# Altium project Baicuoiki.PrjPcb
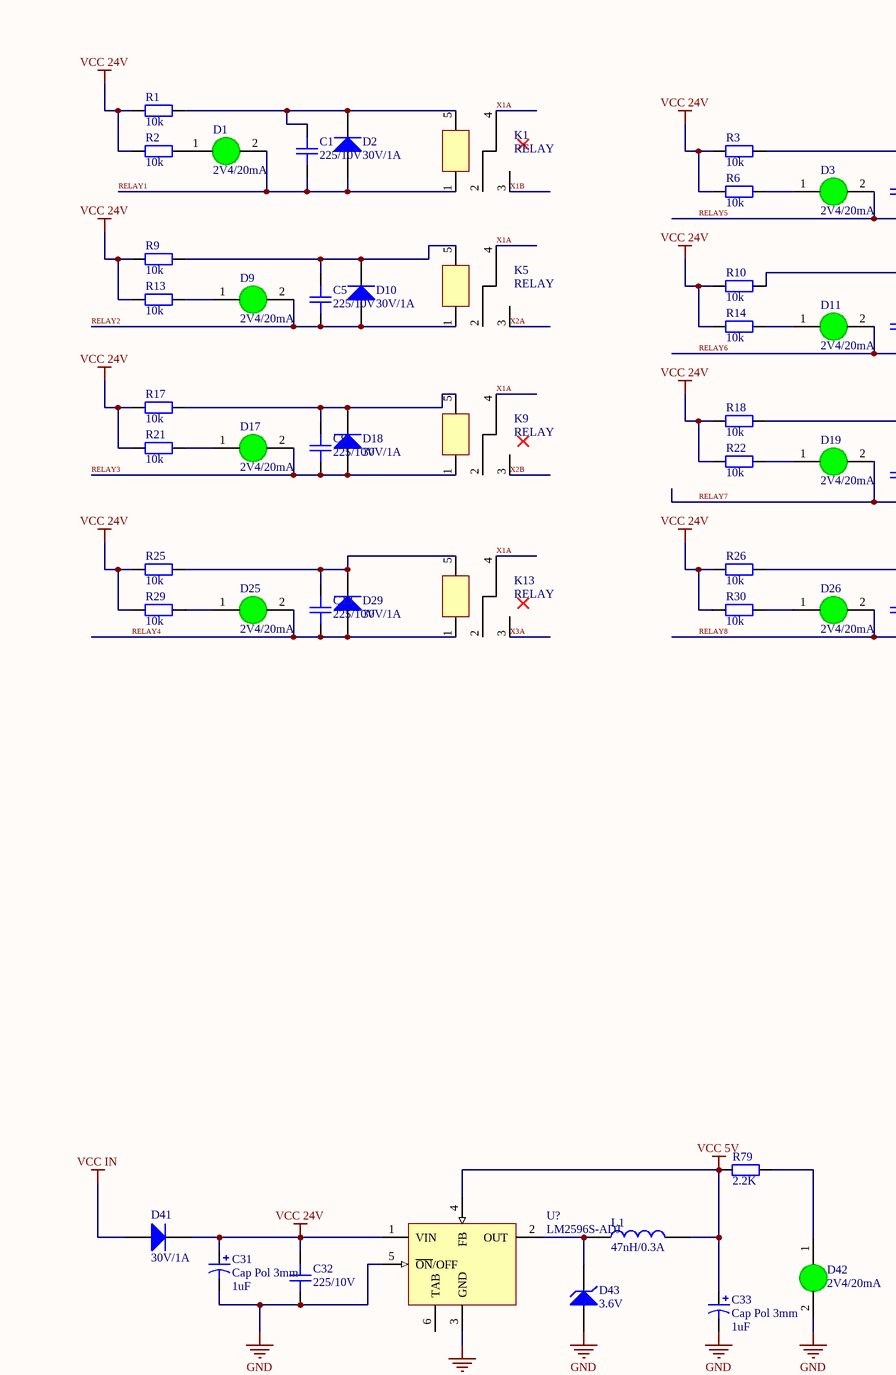
[diagram p0: baicuoiki.SchDoc, top left]
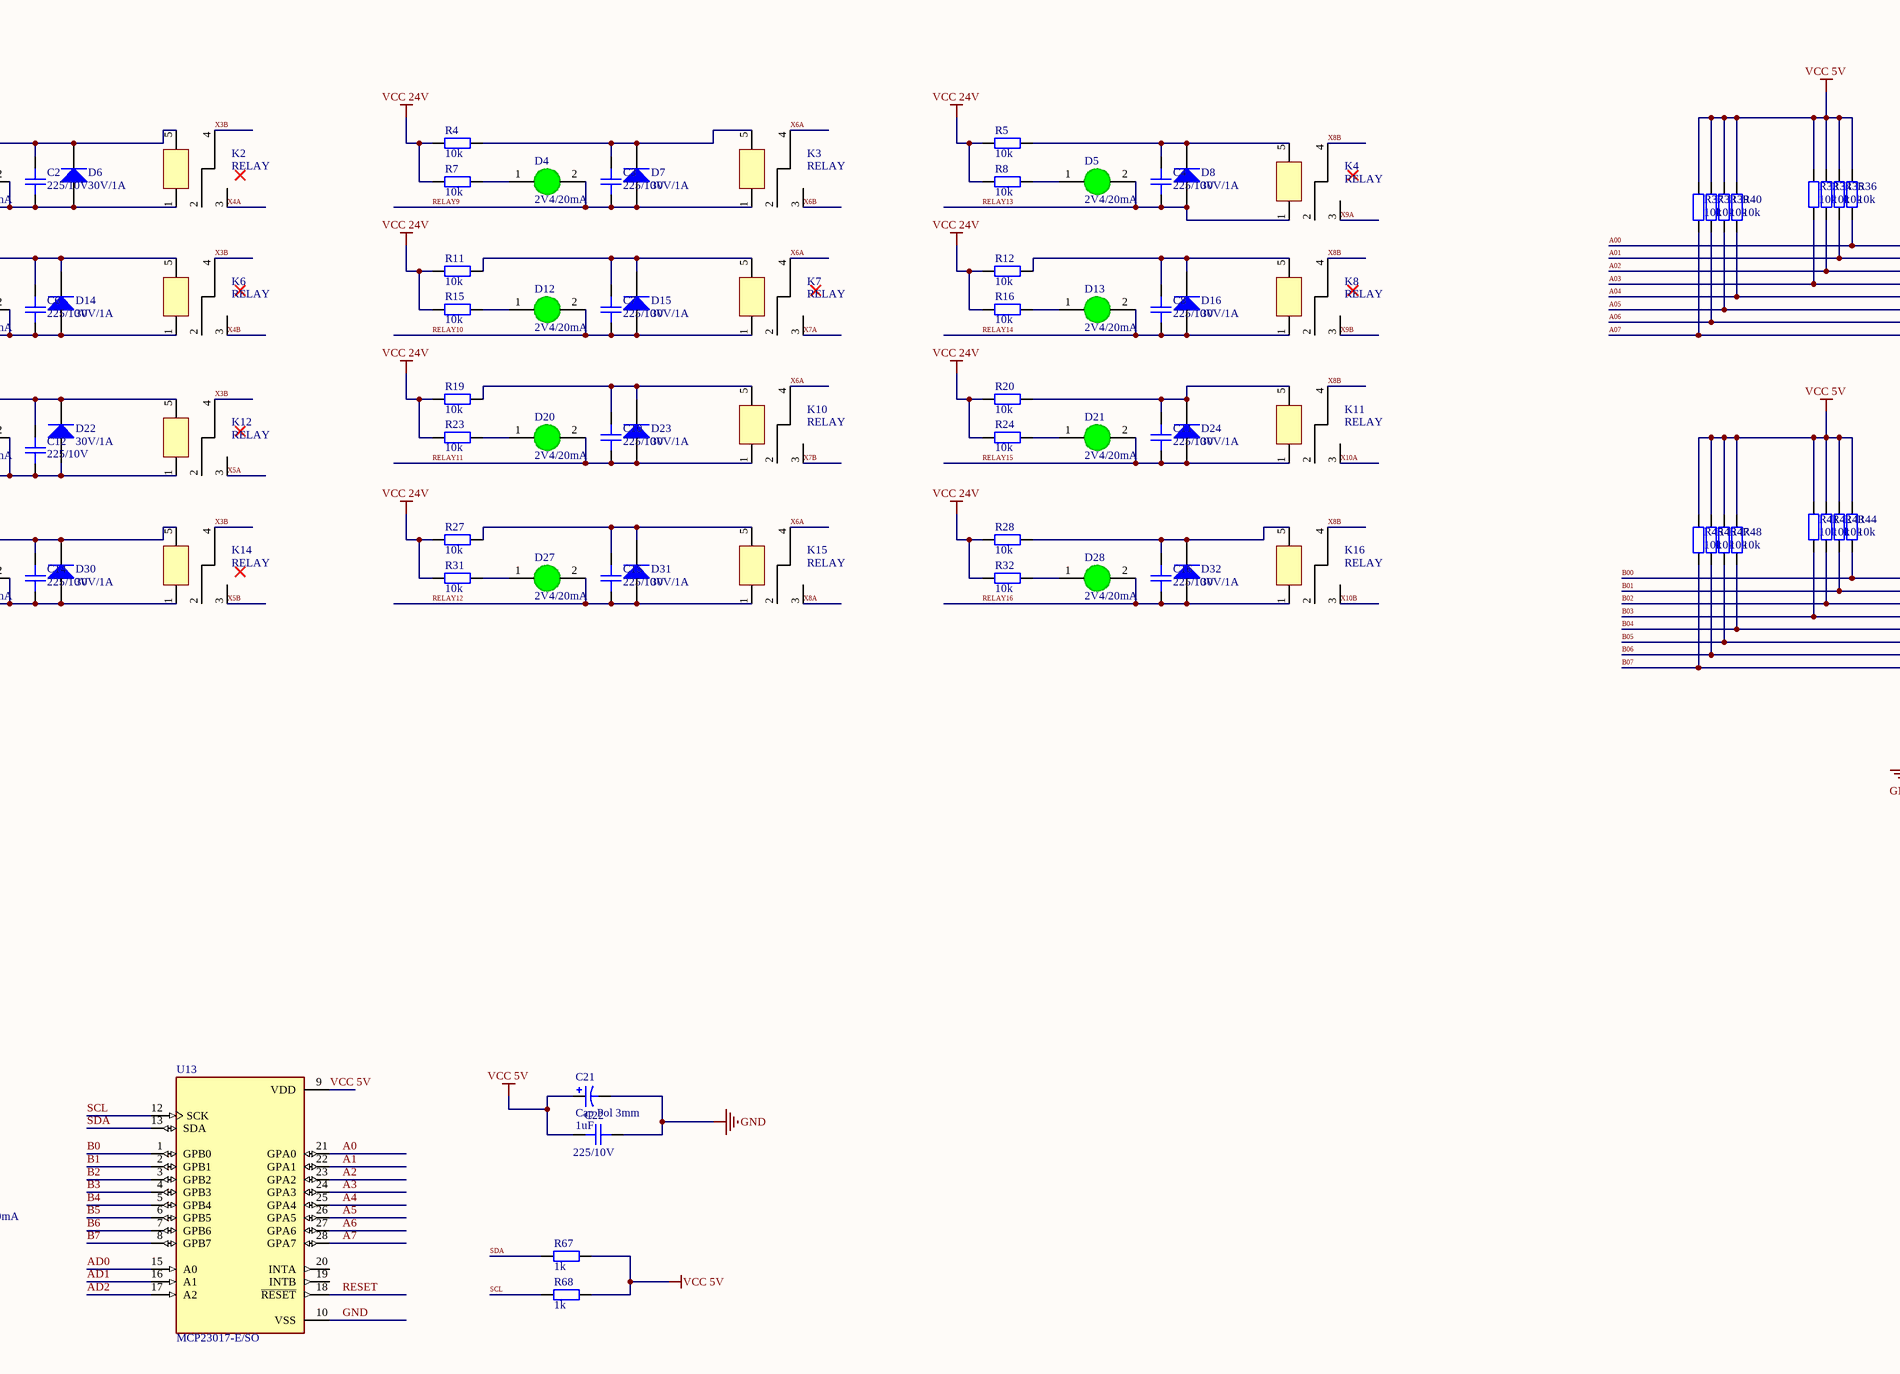
[diagram p1: baicuoiki.SchDoc, top middle]
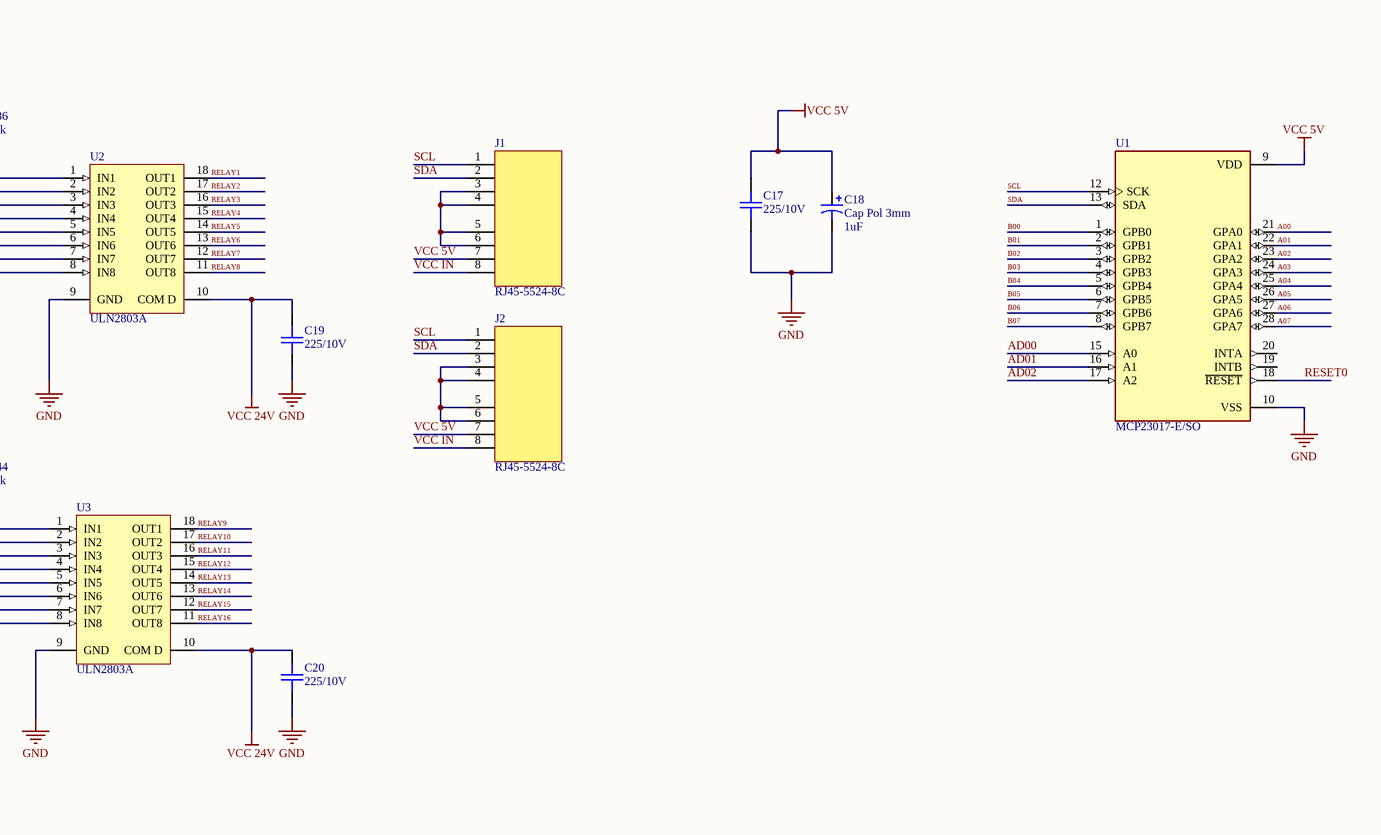
[diagram p2: baicuoiki.SchDoc, top right]
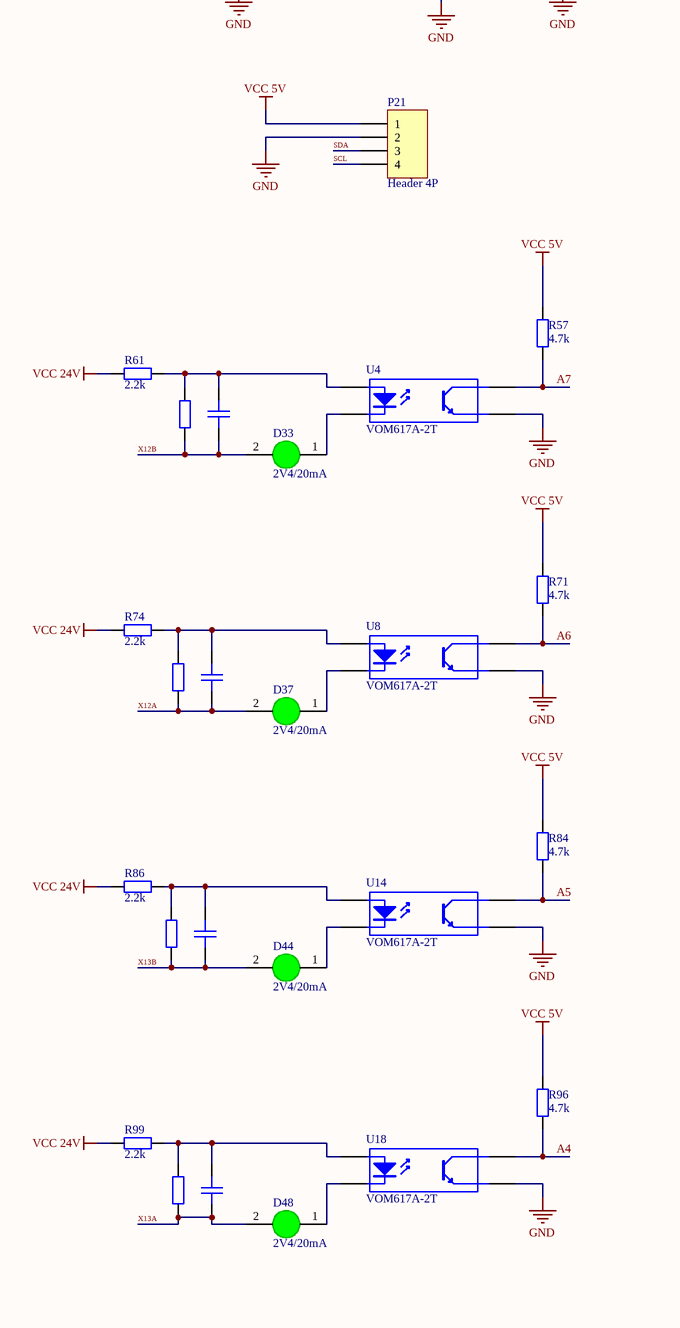
[diagram p3: baicuoiki.SchDoc, bottom left]
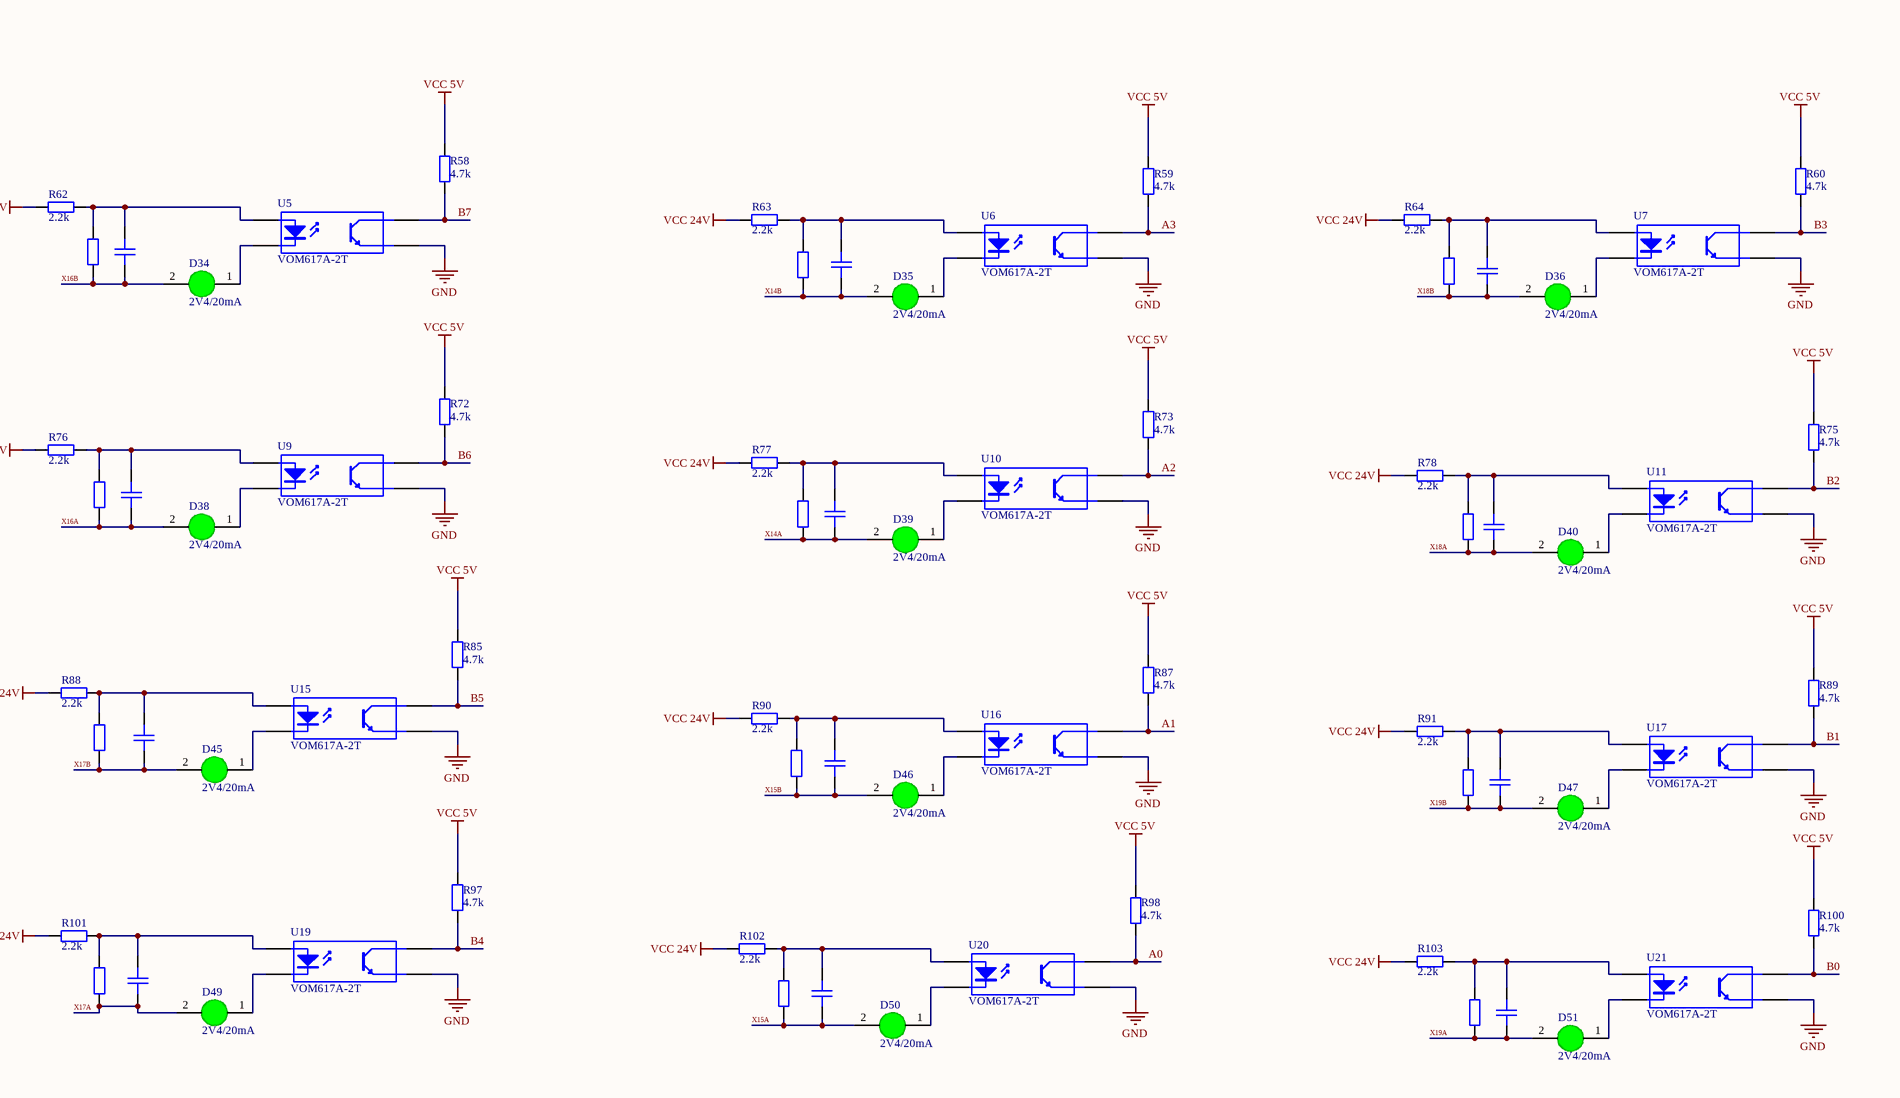
[diagram p4: baicuoiki.SchDoc, bottom middle]
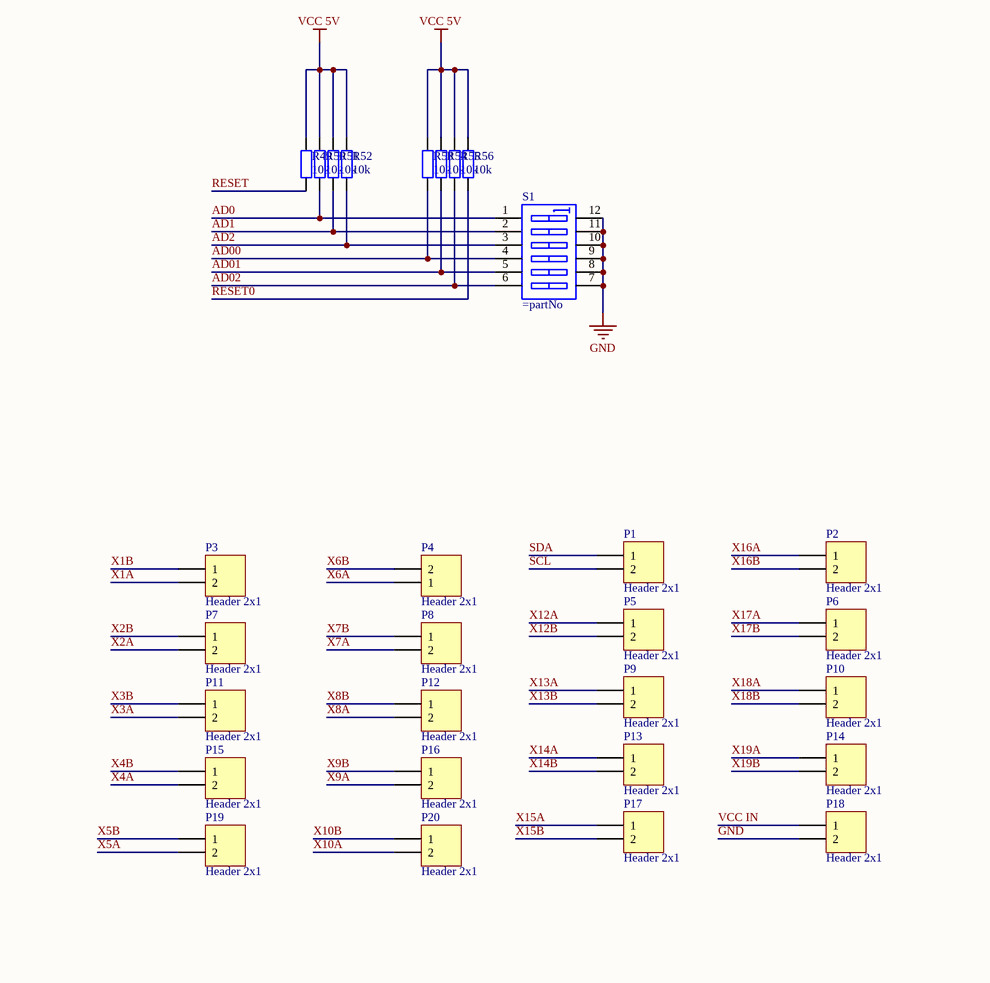
[diagram p5: baicuoiki.SchDoc, bottom right]
1 sheet, 261 parts. Net scope: global (net labels, ports and power ports of the same name join across sheets).
Board file: baicuoiki.PcbDoc

## Sheet baicuoiki.SchDoc
size D

### Parts
C1  225/10V  [CAPC-0805 (2012)]
C2  225/10V  [CAPC-0805 (2012)]
C3  225/10V  [CAPC-0805 (2012)]
C4  225/10V  [CAPC-0805 (2012)]
C5  225/10V  [CAPC-0805 (2012)]
C6  225/10V  [CAPC-0805 (2012)]
C7  225/10V  [CAPC-0805 (2012)]
C8  225/10V  [CAPC-0805 (2012)]
C9  225/10V  [CAPC-0805 (2012)]
C10  225/10V  [CAPC-0805 (2012)]
C11  225/10V  [CAPC-0805 (2012)]
C12  225/10V  [CAPC-0805 (2012)]
C13  225/10V  [CAPC-0805 (2012)]
C14  225/10V  [CAPC-0805 (2012)]
C15  225/10V  [CAPC-0805 (2012)]
C16  225/10V  [CAPC-0805 (2012)]
C17  225/10V  [CAPC-0805 (2012)]
C18  Cap Pol 3mm  [CAPC-0603 (1608)]
C19  225/10V  [CAPC-0805 (2012)]
C20  225/10V  [CAPC-0805 (2012)]
C21  Cap Pol 3mm  [C3MM]
C22  225/10V  [CAPC-0805 (2012)]
C23  225/10V  [CAPC-0805 (2012)]  (value not drawn)
C24  225/10V  [CAPC-0805 (2012)]  (value not drawn)
C25  225/10V  [CAPC-0805 (2012)]  (value not drawn)
C26  225/10V  [CAPC-0805 (2012)]  (value not drawn)
C27  225/10V  [CAPC-0805 (2012)]  (value not drawn)
C28  225/10V  [CAPC-0805 (2012)]  (value not drawn)
C29  225/10V  [CAPC-0805 (2012)]  (value not drawn)
C30  225/10V  [CAPC-0805 (2012)]  (value not drawn)
C31  Cap Pol 3mm  [C3MM]
C32  225/10V  [CAPC-0805 (2012)]
C33  Cap Pol 3mm  [C3MM]
C34  225/10V  [CAPC-0805 (2012)]  (value not drawn)
C35  225/10V  [CAPC-0805 (2012)]  (value not drawn)
C36  225/10V  [CAPC-0805 (2012)]  (value not drawn)
C37  225/10V  [CAPC-0805 (2012)]  (value not drawn)
C38  225/10V  [CAPC-0805 (2012)]  (value not drawn)
C39  225/10V  [CAPC-0805 (2012)]  (value not drawn)
C40  225/10V  [CAPC-0805 (2012)]  (value not drawn)
C41  225/10V  [CAPC-0805 (2012)]  (value not drawn)
D1  2V4/20mA  [LED_0805_GREEN]
D2  30V/1A  [DIODE_DFLS130L]
D3  2V4/20mA  [LED_0805_GREEN]
D4  2V4/20mA  [LED_0805_GREEN]
D5  2V4/20mA  [LED_0805_GREEN]
D6  30V/1A  [DIODE_DFLS130L]
D7  30V/1A  [DIODE_DFLS130L]
D8  30V/1A  [DIODE_DFLS130L]
D9  2V4/20mA  [LED_0805_GREEN]
D10  30V/1A  [DIODE_DFLS130L]
D11  2V4/20mA  [LED_0805_GREEN]
D12  2V4/20mA  [LED_0805_GREEN]
D13  2V4/20mA  [LED_0805_GREEN]
D14  30V/1A  [DIODE_DFLS130L]
D15  30V/1A  [DIODE_DFLS130L]
D16  30V/1A  [DIODE_DFLS130L]
D17  2V4/20mA  [LED_0805_GREEN]
D18  30V/1A  [DIODE_DFLS130L]
D19  2V4/20mA  [LED_0805_GREEN]
D20  2V4/20mA  [LED_0805_GREEN]
D21  2V4/20mA  [LED_0805_GREEN]
D22  30V/1A  [DIODE_DFLS130L]
D23  30V/1A  [DIODE_DFLS130L]
D24  30V/1A  [DIODE_DFLS130L]
D25  2V4/20mA  [LED_0805_GREEN]
D26  2V4/20mA  [LED_0805_GREEN]
D27  2V4/20mA  [LED_0805_GREEN]
D28  2V4/20mA  [LED_0805_GREEN]
D29  30V/1A  [DIODE_DFLS130L]
D30  30V/1A  [DIODE_DFLS130L]
D31  30V/1A  [DIODE_DFLS130L]
D32  30V/1A  [DIODE_DFLS130L]
D33  2V4/20mA  [LED_0805_GREEN]
D34  2V4/20mA  [LED_0805_GREEN]
D35  2V4/20mA  [LED_0805_GREEN]
D36  2V4/20mA  [LED_0805_GREEN]
D37  2V4/20mA  [LED_0805_GREEN]
D38  2V4/20mA  [LED_0805_GREEN]
D39  2V4/20mA  [LED_0805_GREEN]
D40  2V4/20mA  [LED_0805_GREEN]
D41  30V/1A  [DIODE_DFLS130L]
D42  2V4/20mA  [LED_0805_GREEN]
D43  3.6V  [SOD-123]
D44  2V4/20mA  [LED_0805_GREEN]
D45  2V4/20mA  [LED_0805_GREEN]
D46  2V4/20mA  [LED_0805_GREEN]
D47  2V4/20mA  [LED_0805_GREEN]
D48  2V4/20mA  [LED_0805_GREEN]
D49  2V4/20mA  [LED_0805_GREEN]
D50  2V4/20mA  [LED_0805_GREEN]
D51  2V4/20mA  [LED_0805_GREEN]
J1  RJ45-5524-8C  [RJ45_5224-8C]
J2  RJ45-5524-8C  [RJ45_5224-8C]
K1  RELAY  [RELAY]
K2  RELAY  [RELAY]
K3  RELAY  [RELAY]
K4  RELAY  [RELAY]
K5  RELAY  [RELAY]
K6  RELAY  [RELAY]
K7  RELAY  [RELAY]
K8  RELAY  [RELAY]
K9  RELAY  [RELAY]
K10  RELAY  [RELAY]
K11  RELAY  [RELAY]
K12  RELAY  [RELAY]
K13  RELAY  [RELAY]
K14  RELAY  [RELAY]
K15  RELAY  [RELAY]
K16  RELAY  [RELAY]
L1  47nH/0.3A  [IND-0603 (1608)]
P1  Header 2x1  [HED2]
P2  Header 2x1  [HED2]
P3  Header 2x1  [HED2]
P4  Header 2x1  [HED2]
P5  Header 2x1  [HED2]
P6  Header 2x1  [HED2]
P7  Header 2x1  [HED2]
P8  Header 2x1  [HED2]
P9  Header 2x1  [HED2]
P10  Header 2x1  [HED2]
P11  Header 2x1  [HED2]
P12  Header 2x1  [HED2]
P13  Header 2x1  [HED2]
P14  Header 2x1  [HED2]
P15  Header 2x1  [HED2]
P16  Header 2x1  [HED2]
P17  Header 2x1  [HED2]
P18  Header 2x1  [HED2]
P19  Header 2x1  [HED2]
P20  Header 2x1  [HED2]
P21  Header 4P  [HDR1X4]
R1  10k  [RESC-0603 (1608)]
R2  10k  [RESC-0603 (1608)]
R3  10k  [RESC-0603 (1608)]
R4  10k  [RESC-0603 (1608)]
R5  10k  [RESC-0603 (1608)]
R6  10k  [RESC-0603 (1608)]
R7  10k  [RESC-0603 (1608)]
R8  10k  [RESC-0603 (1608)]
R9  10k  [RESC-0603 (1608)]
R10  10k  [RESC-0603 (1608)]
R11  10k  [RESC-0603 (1608)]
R12  10k  [RESC-0603 (1608)]
R13  10k  [RESC-0603 (1608)]
R14  10k  [RESC-0603 (1608)]
R15  10k  [RESC-0603 (1608)]
R16  10k  [RESC-0603 (1608)]
R17  10k  [RESC-0603 (1608)]
R18  10k  [RESC-0603 (1608)]
R19  10k  [RESC-0603 (1608)]
R20  10k  [RESC-0603 (1608)]
R21  10k  [RESC-0603 (1608)]
R22  10k  [RESC-0603 (1608)]
R23  10k  [RESC-0603 (1608)]
R24  10k  [RESC-0603 (1608)]
R25  10k  [RESC-0603 (1608)]
R26  10k  [RESC-0603 (1608)]
R27  10k  [RESC-0603 (1608)]
R28  10k  [RESC-0603 (1608)]
R29  10k  [RESC-0603 (1608)]
R30  10k  [RESC-0603 (1608)]
R31  10k  [RESC-0603 (1608)]
R32  10k  [RESC-0603 (1608)]
R33  10k  [RESC-0603 (1608)]
R34  10k  [RESC-0603 (1608)]
R35  10k  [RESC-0603 (1608)]
R36  10k  [RESC-0603 (1608)]
R37  10k  [RESC-0603 (1608)]
R38  10k  [RESC-0603 (1608)]
R39  10k  [RESC-0603 (1608)]
R40  10k  [RESC-0603 (1608)]
R41  10k  [RESC-0603 (1608)]
R42  10k  [RESC-0603 (1608)]
R43  10k  [RESC-0603 (1608)]
R44  10k  [RESC-0603 (1608)]
R45  10k  [RESC-0603 (1608)]
R46  10k  [RESC-0603 (1608)]
R47  10k  [RESC-0603 (1608)]
R48  10k  [RESC-0603 (1608)]
R49  10k  [RESC-0603 (1608)]
R50  10k  [RESC-0603 (1608)]
R51  10k  [RESC-0603 (1608)]
R52  10k  [RESC-0603 (1608)]
R53  10k  [RESC-0603 (1608)]
R54  10k  [RESC-0603 (1608)]
R55  10k  [RESC-0603 (1608)]
R56  10k  [RESC-0603 (1608)]
R57  4.7k  [RESC-0603 (1608)]
R58  4.7k  [RESC-0603 (1608)]
R59  4.7k  [RESC-0603 (1608)]
R60  4.7k  [RESC-0603 (1608)]
R61  2.2k  [RESC-0603 (1608)]
R62  2.2k  [RESC-0603 (1608)]
R63  2.2k  [RESC-0603 (1608)]
R64  2.2k  [RESC-0603 (1608)]
R65  10k  [RESC-0603 (1608)]  (value not drawn)
R66  10k  [RESC-0603 (1608)]  (value not drawn)
R67  1k  [RESC-0603 (1608)]
R68  1k  [RESC-0603 (1608)]
R69  10k  [RESC-0603 (1608)]  (value not drawn)
R70  10k  [RESC-0603 (1608)]  (value not drawn)
R71  4.7k  [RESC-0603 (1608)]
R72  4.7k  [RESC-0603 (1608)]
R73  4.7k  [RESC-0603 (1608)]
R74  2.2k  [RESC-0603 (1608)]
R75  4.7k  [RESC-0603 (1608)]
R76  2.2k  [RESC-0603 (1608)]
R77  2.2k  [RESC-0603 (1608)]
R78  2.2k  [RESC-0603 (1608)]
R79  2.2K  [RESC-0603 (1608)]
R80  10k  [RESC-0603 (1608)]  (value not drawn)
R81  10k  [RESC-0603 (1608)]  (value not drawn)
R82  10k  [RESC-0603 (1608)]  (value not drawn)
R83  10k  [RESC-0603 (1608)]  (value not drawn)
R84  4.7k  [RESC-0603 (1608)]
R85  4.7k  [RESC-0603 (1608)]
R86  2.2k  [RESC-0603 (1608)]
R87  4.7k  [RESC-0603 (1608)]
R88  2.2k  [RESC-0603 (1608)]
R89  4.7k  [RESC-0603 (1608)]
R90  2.2k  [RESC-0603 (1608)]
R91  2.2k  [RESC-0603 (1608)]
R92  10k  [RESC-0603 (1608)]  (value not drawn)
R93  10k  [RESC-0603 (1608)]  (value not drawn)
R94  10k  [RESC-0603 (1608)]  (value not drawn)
R95  10k  [RESC-0603 (1608)]  (value not drawn)
R96  4.7k  [RESC-0603 (1608)]
R97  4.7k  [RESC-0603 (1608)]
R98  4.7k  [RESC-0603 (1608)]
R99  2.2k  [RESC-0603 (1608)]
R100  4.7k  [RESC-0603 (1608)]
R101  2.2k  [RESC-0603 (1608)]
R102  2.2k  [RESC-0603 (1608)]
R103  2.2k  [RESC-0603 (1608)]
R104  10k  [RESC-0603 (1608)]  (value not drawn)
R105  10k  [RESC-0603 (1608)]  (value not drawn)
R106  10k  [RESC-0603 (1608)]  (value not drawn)
R107  10k  [RESC-0603 (1608)]  (value not drawn)
S1  (no value)  [SW-DIP6]
U1  MCP23017-E/SO  [SOIC127P1030X265-28N]
U2  ULN2803A  [SO18]
U3  ULN2803A  [SO18]
U4  VOM617A-2T  [OPTO TRANSISTOR_SOP-4]
U5  VOM617A-2T  [OPTO TRANSISTOR_SOP-4]
U6  VOM617A-2T  [OPTO TRANSISTOR_SOP-4]
U7  VOM617A-2T  [OPTO TRANSISTOR_SOP-4]
U8  VOM617A-2T  [OPTO TRANSISTOR_SOP-4]
U9  VOM617A-2T  [OPTO TRANSISTOR_SOP-4]
U10  VOM617A-2T  [OPTO TRANSISTOR_SOP-4]
U11  VOM617A-2T  [OPTO TRANSISTOR_SOP-4]
U13  MCP23017-E/SO  [SOIC127P1030X265-28N]
U14  VOM617A-2T  [OPTO TRANSISTOR_SOP-4]
U15  VOM617A-2T  [OPTO TRANSISTOR_SOP-4]
U16  VOM617A-2T  [OPTO TRANSISTOR_SOP-4]
U17  VOM617A-2T  [OPTO TRANSISTOR_SOP-4]
U18  VOM617A-2T  [OPTO TRANSISTOR_SOP-4]
U19  VOM617A-2T  [OPTO TRANSISTOR_SOP-4]
U20  VOM617A-2T  [OPTO TRANSISTOR_SOP-4]
U21  VOM617A-2T  [OPTO TRANSISTOR_SOP-4]
U?  LM2596S-ADJ  [TO263-5]

### Nets
GND: C17.2 C18.2 C19.2 C20.2 C21.2 C22.2 C31.2 C32.1 C33.2 D42.2(K) D43.1(A) P18.2 P21.2 S1.7 S1.8 S1.9 S1.10 S1.11 S1.12 U1.10(VSS) U2.9(GND) U3.9(GND) U4.3 U5.3 U6.3 U7.3 U8.3 U9.3 U10.3 U11.3 U13.10(VSS) U14.3 U15.3 U16.3 U17.3 U18.3 U19.3 U20.3 U21.3 U?.3(GND) U?.5(~{ON}/OFF)
VCC 5V: C17.1 C18.1 C21.1 C22.1 C33.1 J1.7 J2.7 L1.2 P21.1 R33.1 R34.1 R35.1 R36.1 R37.1 R38.1 R39.1 R40.1 R41.1 R42.1 R43.1 R44.1 R45.1 R46.1 R47.1 R48.1 R49.1 R50.1 R51.1 R52.1 R53.1 R54.1 R55.1 R56.1 R57.1 R58.1 R59.1 R60.1 R67.1 R68.1 R71.1 R72.1 R73.1 R75.1 R79.2 R84.1 R85.1 R87.1 R89.1 R96.1 R97.1 R98.1 R100.1 U1.9(VDD) U13.9(VDD) U?.4(FB)
VCC 24V: C19.1 C20.1 C31.1 C32.2 D41.2(K) R1.2 R2.2 R3.2 R4.2 R5.2 R6.2 R7.2 R8.2 R9.2 R10.2 R11.2 R12.2 R13.2 R14.2 R15.2 R16.2 R17.2 R18.2 R19.2 R20.2 R21.2 R22.2 R23.2 R24.2 R25.2 R26.2 R27.2 R28.2 R29.2 R30.2 R31.2 R32.2 R61.2 R62.2 R63.2 R64.2 R74.2 R76.2 R77.2 R78.2 R86.2 R88.2 R90.2 R91.2 R99.2 R101.2 R102.2 R103.2 U2.10(COM_D) U3.10(COM_D) U?.1(VIN)
VCC IN: D41.1(A) J1.8 J2.8 P18.1
A00: R36.2 U1.21(GPA0) U2.1(IN1)
A0: R98.2 U13.21(GPA0) U20.4
A01: R35.2 U1.22(GPA1) U2.2(IN2)
A1: R87.2 U13.22(GPA1) U16.4
A02: R34.2 U1.23(GPA2) U2.3(IN3)
A2: R73.2 U10.4 U13.23(GPA2)
A03: R33.2 U1.24(GPA3) U2.4(IN4)
A3: R59.2 U6.4 U13.24(GPA3)
A04: R40.2 U1.25(GPA4) U2.5(IN5)
A4: R96.2 U13.25(GPA4) U18.4
A05: R39.2 U1.26(GPA5) U2.6(IN6)
A5: R84.2 U13.26(GPA5) U14.4
A06: R38.2 U1.27(GPA6) U2.7(IN7)
A6: R71.2 U8.4 U13.27(GPA6)
A07: R37.2 U1.28(GPA7) U2.8(IN8)
A7: R57.2 U4.4 U13.28(GPA7)
AD00: R53.2 S1.4 U1.15(A0)
AD0: R50.2 S1.1 U13.15(A0)
AD01: R54.2 S1.5 U1.16(A1)
AD1: R51.2 S1.2 U13.16(A1)
AD02: R55.2 S1.6 U1.17(A2)
AD2: R52.2 S1.3 U13.17(A2)
B00: R44.2 U1.1(GPB0) U3.1(IN1)
B0: R100.2 U13.1(GPB0) U21.4
B01: R43.2 U1.2(GPB1) U3.2(IN2)
B1: R89.2 U13.2(GPB1) U17.4
B02: R42.2 U1.3(GPB2) U3.3(IN3)
B2: R75.2 U11.4 U13.3(GPB2)
B03: R41.2 U1.4(GPB3) U3.4(IN4)
B3: R60.2 U7.4 U13.4(GPB3)
B04: R48.2 U1.5(GPB4) U3.5(IN5)
B4: R97.2 U13.5(GPB4) U19.4
B05: R47.2 U1.6(GPB5) U3.6(IN6)
B5: R85.2 U13.6(GPB5) U15.4
B06: R46.2 U1.7(GPB6) U3.7(IN7)
B6: R72.2 U9.4 U13.7(GPB6)
B07: R45.2 U1.8(GPB7) U3.8(IN8)
B7: R58.2 U5.4 U13.8(GPB7)
RELAY1: C1.1 D1.2(K) D2.1(A) K1.1 U2.18(OUT1)
RELAY2: C5.1 D9.2(K) D10.1(A) K5.1 U2.17(OUT2)
RELAY3: C9.1 D17.2(K) D18.1(A) K9.1 U2.16(OUT3)
RELAY4: C13.1 D25.2(K) D29.1(A) K13.1 U2.15(OUT4)
RELAY5: C2.1 D3.2(K) D6.1(A) K2.1 U2.14(OUT5)
RELAY6: C6.1 D11.2(K) D14.1(A) K6.1 U2.13(OUT6)
RELAY7: C12.1 D19.2(K) D22.1(A) K12.1 U2.12(OUT7)
RELAY8: C14.1 D26.2(K) D30.1(A) K14.1 U2.11(OUT8)
RELAY9: C3.1 D4.2(K) D7.1(A) K3.1 U3.18(OUT1)
RELAY10: C7.1 D12.2(K) D15.1(A) K7.1 U3.17(OUT2)
RELAY11: C10.1 D20.2(K) D23.1(A) K10.1 U3.16(OUT3)
RELAY12: C15.1 D27.2(K) D31.1(A) K15.1 U3.15(OUT4)
RELAY13: C4.1 D5.2(K) D8.1(A) K4.1 U3.14(OUT5)
RELAY14: C8.1 D13.2(K) D16.1(A) K8.1 U3.13(OUT6)
RELAY15: C11.1 D21.2(K) D24.1(A) K11.1 U3.12(OUT7)
RELAY16: C16.1 D28.2(K) D32.1(A) K16.1 U3.11(OUT8)
RESET: R49.2 U13.18(~{RESET})
RESET0: R56.2 U1.18(~{RESET})
SCL: J1.1 J2.1 P1.2 P21.4 R68.2 U1.12(SCK) U13.12(SCK)
SDA: J1.2 J2.2 P1.1 P21.3 R67.2 U1.13(SDA) U13.13(SDA)
X1A: K1.4 K5.4 K9.4 K13.4 P3.2
X1B: K1.3 P3.1
X2A: K5.3 P7.2
X2B: K9.3 P7.1
X3A: K13.3 P11.2
X3B: K2.4 K6.4 K12.4 K14.4 P11.1
X4A: K2.3 P15.2
X4B: K6.3 P15.1
X5A: K12.3 P19.2
X5B: K14.3 P19.1
X6A: K3.4 K7.4 K10.4 K15.4 P4.1
X6B: K3.3 P4.2
X7A: K7.3 P8.2
X7B: K10.3 P8.1
X8A: K15.3 P12.2
X8B: K4.4 K8.4 K11.4 K16.4 P12.1
X9A: K4.3 P16.2
X9B: K8.3 P16.1
X10A: K11.3 P20.2
X10B: K16.3 P20.1
X12A: C27.1 D37.2(K) P5.1 R80.2
X12B: C23.1 D33.2(K) P5.2 R65.2
X13A: C38.1 D48.2(K) P9.1 R104.2
X13B: C34.1 D44.2(K) P9.2 R92.2
X14A: C29.1 D39.2(K) P13.1 R82.2
X14B: C25.1 D35.2(K) P13.2 R69.2
X15A: C40.1 D50.2(K) P17.1 R106.2
X15B: C36.1 D46.2(K) P17.2 R94.2
X16A: C28.1 D38.2(K) P2.1 R81.2
X16B: C24.1 D34.2(K) P2.2 R66.2
X17A: C39.1 D49.2(K) P6.1 R105.2
X17B: C35.1 D45.2(K) P6.2 R93.2
X18A: C30.1 D40.2(K) P10.1 R83.2
X18B: C26.1 D36.2(K) P10.2 R70.2
X19A: C41.1 D51.2(K) P14.1 R107.2
X19B: C37.1 D47.2(K) P14.2 R95.2
NetC1_2: C1.2 D2.2(K) K1.5 R1.1
NetC2_2: C2.2 D6.2(K) K2.5 R3.1
NetC3_2: C3.2 D7.2(K) K3.5 R4.1
NetC4_2: C4.2 D8.2(K) K4.5 R5.1
NetC5_2: C5.2 D10.2(K) K5.5 R9.1
NetC6_2: C6.2 D14.2(K) K6.5 R10.1
NetC7_2: C7.2 D15.2(K) K7.5 R11.1
NetC8_2: C8.2 D16.2(K) K8.5 R12.1
NetC9_2: C9.2 D18.2(K) K9.5 R17.1
NetC10_2: C10.2 D23.2(K) K10.5 R19.1
NetC11_2: C11.2 D24.2(K) K11.5 R20.1
NetC12_2: C12.2 D22.2(K) K12.5 R18.1
NetC13_2: C13.2 D29.2(K) K13.5 R25.1
NetC14_2: C14.2 D30.2(K) K14.5 R26.1
NetC15_2: C15.2 D31.2(K) K15.5 R27.1
NetC16_2: C16.2 D32.2(K) K16.5 R28.1
NetC23_2: C23.2 R61.1 R65.1 U4.1
NetC24_2: C24.2 R62.1 R66.1 U5.1
NetC25_2: C25.2 R63.1 R69.1 U6.1
NetC26_2: C26.2 R64.1 R70.1 U7.1
NetC27_2: C27.2 R74.1 R80.1 U8.1
NetC28_2: C28.2 R76.1 R81.1 U9.1
NetC29_2: C29.2 R77.1 R82.1 U10.1
NetC30_2: C30.2 R78.1 R83.1 U11.1
NetC34_2: C34.2 R86.1 R92.1 U14.1
NetC35_2: C35.2 R88.1 R93.1 U15.1
NetC36_2: C36.2 R90.1 R94.1 U16.1
NetC37_2: C37.2 R91.1 R95.1 U17.1
NetC38_2: C38.2 R99.1 R104.1 U18.1
NetC39_2: C39.2 R101.1 R105.1 U19.1
NetC40_2: C40.2 R102.1 R106.1 U20.1
NetC41_2: C41.2 R103.1 R107.1 U21.1
NetD1_1: D1.1(A) R2.1
NetD3_1: D3.1(A) R6.1
NetD4_1: D4.1(A) R7.1
NetD5_1: D5.1(A) R8.1
NetD9_1: D9.1(A) R13.1
NetD11_1: D11.1(A) R14.1
NetD12_1: D12.1(A) R15.1
NetD13_1: D13.1(A) R16.1
NetD17_1: D17.1(A) R21.1
NetD19_1: D19.1(A) R22.1
NetD20_1: D20.1(A) R23.1
NetD21_1: D21.1(A) R24.1
NetD25_1: D25.1(A) R29.1
NetD26_1: D26.1(A) R30.1
NetD27_1: D27.1(A) R31.1
NetD28_1: D28.1(A) R32.1
NetD33_1: D33.1(A) U4.2
NetD34_1: D34.1(A) U5.2
NetD35_1: D35.1(A) U6.2
NetD36_1: D36.1(A) U7.2
NetD37_1: D37.1(A) U8.2
NetD38_1: D38.1(A) U9.2
NetD39_1: D39.1(A) U10.2
NetD40_1: D40.1(A) U11.2
NetD42_1: D42.1(A) R79.1
NetD43_2: D43.2(K) L1.1 U?.2(OUT)
NetD44_1: D44.1(A) U14.2
NetD45_1: D45.1(A) U15.2
NetD46_1: D46.1(A) U16.2
NetD47_1: D47.1(A) U17.2
NetD48_1: D48.1(A) U18.2
NetD49_1: D49.1(A) U19.2
NetD50_1: D50.1(A) U20.2
NetD51_1: D51.1(A) U21.2
NetJ1_3: J1.3 J1.4 J1.5 J1.6
NetJ2_3: J2.3 J2.4 J2.5 J2.6

Not connected (* = marked no-connect by the designer): K1 2; K2 2; K3 2; K4 2; K5 2; K6 2; K7 2; K8 2; K9 2; K10 2; K11 2; K12 2; K13 2; K14 2; K15 2; K16 2; U1 19(INTB) 20(INTA); U13 19(INTB) 20(INTA); U? 6(TAB)

### Notes on the sheet
- (in symbol Cap Pol 3mm) 1uF

### Library data of the parts
C1-C17 C19 C20 C22-C30 C32 C34-C41 = 0805C225K8PAC7800: CAP CER 2.2uF 10% 10V X5R 0805; CompanyID: VT-00292; Solder: SMT; Value: 225/10V; MPN: 0805C225K8PAC7800; Category: CAPACITOR; PinCount: 2
C18 C21 C31 C33 = Cap Pol 3mm: Polarized Capacitor (Axial); Published: 8-Jun-2000; LatestRevisionDate: 17-Jul-2002; LatestRevisionNote: Re-released for DXP Platform.; PackageReference: POLAR0.8; Publisher: Altium Limited
D1 D3-D5 D9 D11-D13 D17 D19-D21 D25-D28 D33-D40 D42 D44-D51 = 17-21/G6C-FM1N2B/3T: LED GREEN CLEAR 2V4 20mA 0805 SMD; CompanyID: VT-00393; Solder: SMT; MPN: 17-21/G6C-FM1N2B/3T; Value: 2V4/20mA
D2 D6-D8 D10 D14-D16 D18 D22-D24 D29-D32 D41 = DFLS130L-7: DIODE SCHOTTKY 30V 1A POWERDI123; CompanyID: VT-00057; Solder: SMT; Value: 30V/1A; MPN: DFLS130L-7
D43 = MMSZ3V6T1G: DIODE ZENER 3.6V 500MW SOD123; MFR: ON; Solder: SMT; Value: 3.6V; MPN: MMSZ3V6T1G
J1 J2 = RJ45_5224-8C: RJ45-12P; Solder: WAVE; MFR_URL: https://vi.aliexpress.com/item/80PCS-x-RJ45-5224-8C-Plastic-PCB-Modular-jack-Network-socket-LAN-CONNECTOR-plug-180degree-top/32722417191.html
L1 = AIMC-0603-47NJ-T: IND-FIXED 47nH 300mA 700 mOhm 0603; CompanyID: VT-01094; Solder: SMT; MPN: AIMC-0603-47NJ-T; Value: 47nH/0.3A; Category: INDUCTOR
P1-P20 = Header 2x1: Header, 2-Pin, pitch 2.54mm; Solder: WAVE
P21 = Header 4x1: Header, 4 Pin Pitch 2.54mm; MPN: S1012EC-40-ND; CompanyID: VT-00125; Solder: WAVE; Value: Header 4P
R1-R107 = AC0603FR-0713KL: RES SMD 13K OHM 1% 1/10W 0603; CompanyID: VT-00329; Solder: SMT; MPN: AC0603FR-0713KL; Value: 13K; Category: RESISTOR
S1 = SWDIP6: WS-DITV 2.54 mm small compact THT flat actuator with top tape; Manufacturer: Wurth Elektronik; Part No.: 418127160906; ComponentLink1 Description: Manufacturer; ComponentLink2 Description: Datasheet; Pole: 06; Created Date: Dec.2015; ComponentLink1URL: http://www.we-online.com; ComponentLink2URL: http://katalog.we-online.de/em/datasheet/4181271609xx.pdf; Created by: Baojun Chen
U1 U13 = MCP23017-E/SO: I/O Expander 16 IÂ²C 1.7MHz 28-SOIC; MF: Microchip; SnapEDA_Link: https://www.snapeda.com/parts/MCP23017-E/SO/Microchip/view-part/48467/?ref=snap; MP: MCP23017-E/SO; Price: None; Value: *; Availability: Unavailable; Package: SOIC-28 Microchip
U2 U3 = ULN2803A: High-Voltage, High-Current Darlington Array; Published: 13-Oct-2000; LatestRevisionDate: 06-Jun-2005; LatestRevisionNote: Stylized 3D Model Added.; DatasheetVersion: 1999; PackageVersion: 1999; PackageReference: A18; Publisher: Altium Limited; PackageDescription: DIP; 18 Leads; Row Spacing 7.62 mm; Pitch 2.54 mm; ComponentLink1Description: Manufacturer Link; ComponentLink1URL: http://www.allegromicro.com/
U4-U11 U14-U21 = VOM617A-2T: OPTOISOLATOR 3.75KV TRANS 4-SOP; Solder: SMT; CompanyID: VT-xxxx; MPN: VOM617A-2T; Value: VOM617A-2T
U? = LM2596S-ADJ: SIMPLE SWITCHER Power Converter 150 KHz 3A Step-Down Voltage Regulator; MPN: LM2596SX-ADJ/NOPB; Solder: SMT; Value: LM2596S-ADJ; Category: IC